# EAGLE design myir_zynq_7020_io_1 (EAGLE 7.3.0)
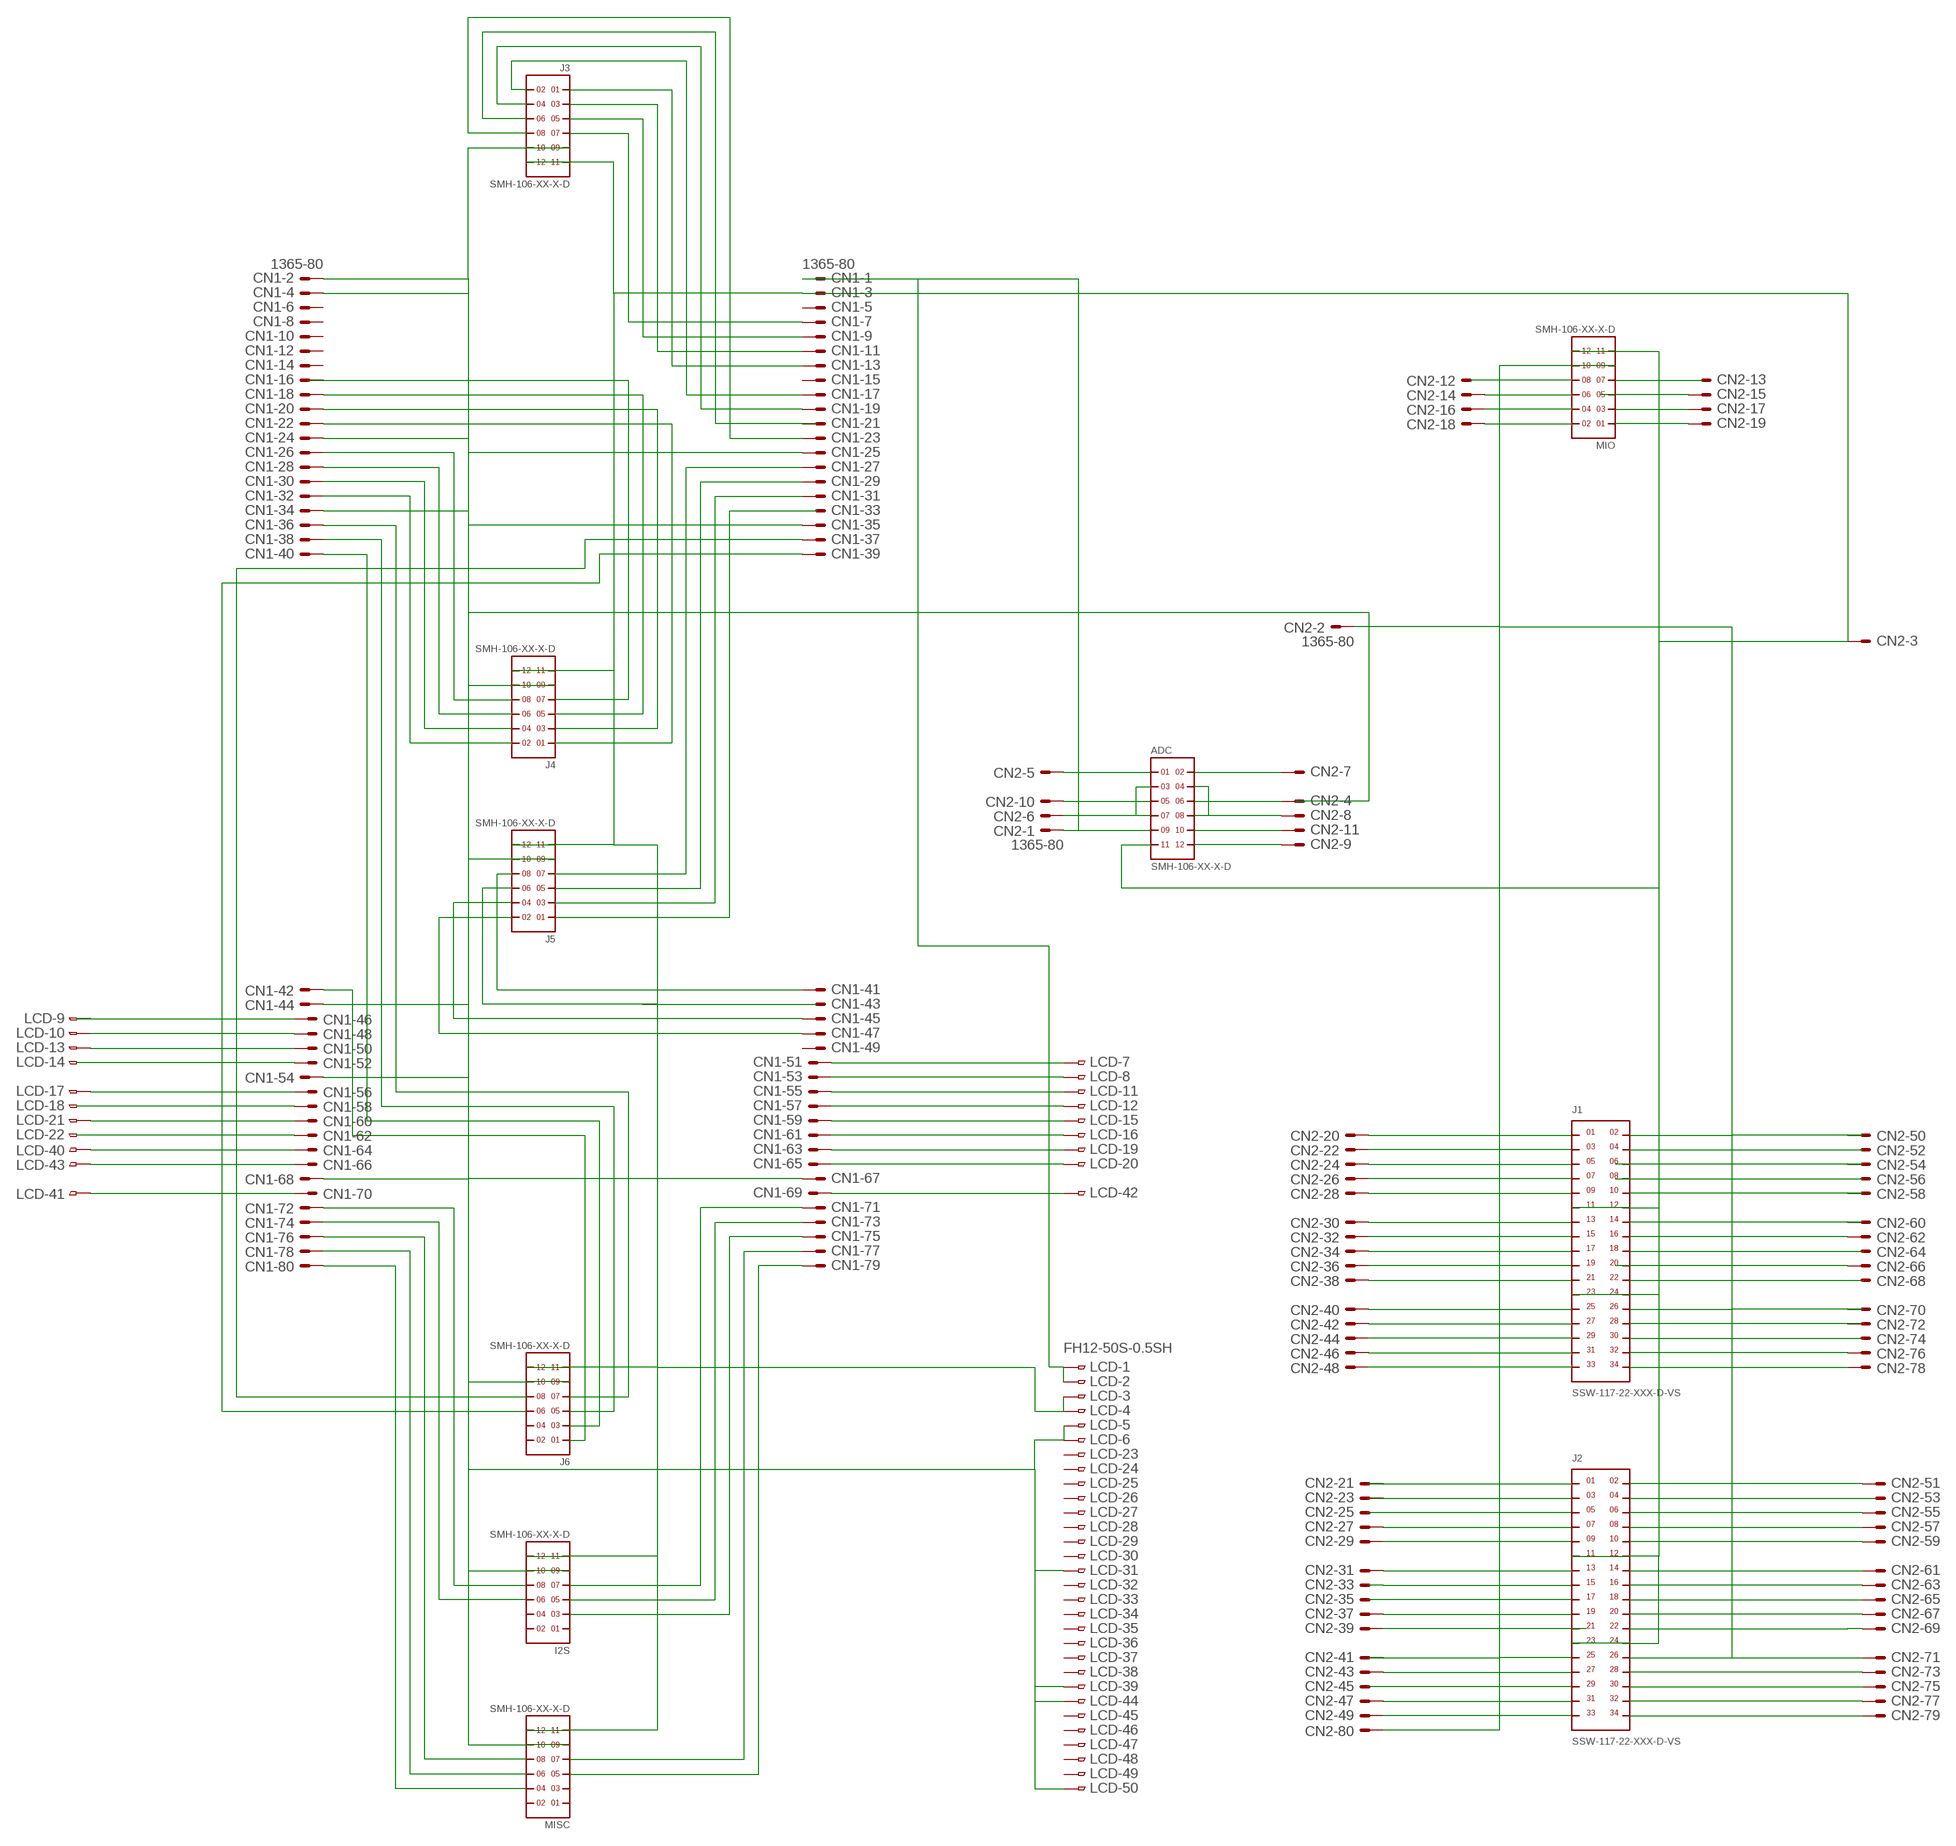
[diagram p0: schematic, sheet 1]

## Parts
ADC  SMH-106-XX-X-D  [SMH-106-XX-X-D]
CN1  1365-80  [1365-80]
CN2  1365-80  [1365-80]
I2S  SMH-106-XX-X-D  [SMH-106-XX-X-D]
J1  SSW-117-22-XXX-D-VS  [SSW-117-22-XXX-D-VS]
J2  SSW-117-22-XXX-D-VS  [SSW-117-22-XXX-D-VS]
J3  SMH-106-XX-X-D  [SMH-106-XX-X-D]
J4  SMH-106-XX-X-D  [SMH-106-XX-X-D]
J5  SMH-106-XX-X-D  [SMH-106-XX-X-D]
J6  SMH-106-XX-X-D  [SMH-106-XX-X-D]
LCD  FH12-50S-0.5SH  [FH12-50S-0.5SH]
MIO  SMH-106-XX-X-D  [SMH-106-XX-X-D]
MISC  SMH-106-XX-X-D  [SMH-106-XX-X-D]

## Nets
N$1: CN1.70 LCD.41
N$2: CN1.53 LCD.8
N$3: CN1.66 LCD.43
N$4: CN1.7 J3.7
N$5: CN1.9 J3.5
N$6: CN1.11 J3.3
N$7: CN1.13 J3.1
N$8: CN1.64 LCD.40
N$9: CN1.40 J6.3
N$10: CN1.38 J6.5
N$11: CN1.36 J6.7
N$12: CN1.42 J6.1
N$14: CN1.27 J5.7
N$15: CN1.29 J5.5
N$16: CN1.31 J5.3
N$17: J5.1
N$18: ADC.11 CN1.3 CN2.3 I2S.11 I2S.12 J1.11 J1.12 J1.23 J1.24 J2.11 J2.12 J2.23 J2.24 J3.11 J3.12 J4.11 J4.12 J5.6 J5.11 J5.12 J6.11 J6.12 LCD.3 LCD.4 MIO.11 MIO.12 MISC.11 MISC.12
N$20: CN1.41 J5.8
N$21: CN1.37 J6.8
N$22: CN1.39 J6.6
N$23: CN1.45 J5.4
N$26: CN1.51 LCD.7
N$27: CN2.62 J1.16
N$28: J1.28
N$30: J1.10
N$31: J1.18
N$32: CN2.66
N$33: J1.22
N$34: CN1.55 LCD.11
N$35: J1.30
N$36: CN1.71 I2S.7
N$37: CN1.73 I2S.5
N$38: CN1.75 I2S.3
N$39: CN1.77 MISC.7
N$40: CN1.79 MISC.5
N$41: CN1.2 CN1.4 CN1.24 CN1.25 CN1.34 CN1.35 CN1.44 CN1.54 CN1.67 CN1.68 CN2.2 CN2.20 CN2.30 CN2.31 CN2.40 CN2.51 CN2.61 CN2.71 CN2.80 I2S.9 I2S.10 J1.1 J1.2 J1.13 J1.14 J1.25 J1.26 J2.1 J2.2 J2.13 J2.14 J2.25 J2.26 J3.9 J3.10 J4.9 J4.10 J5.9 J5.10 J6.9 J6.10 LCD.5 LCD.6 LCD.31 LCD.39 LCD.44 LCD.50 MIO.9 MIO.10 MISC.9 MISC.10
N$42: CN1.57 LCD.12
N$43: CN2.76 J1.32
N$44: CN2.69 J2.22
N$45: CN2.67 J2.20
N$46: CN2.65 J2.18
N$47: CN2.63 J2.16
N$48: CN1.16 J4.7
N$49: CN1.18 J4.5
N$50: CN1.20 J4.3
N$51: CN1.17 J3.2
N$52: CN1.59 LCD.15
N$53: CN1.26 J4.8
N$54: CN1.28 J4.6
N$55: CN1.30 J4.4
N$56: CN1.61 LCD.16
N$57: CN1.32 J4.2
N$61: CN1.63 LCD.19
N$62: CN1.65 LCD.20
N$63: CN2.18 MIO.2
N$64: CN2.59 J2.10
N$65: CN2.57 J2.8
N$66: CN2.55 J2.6
N$67: CN1.46
N$68: J2.4
N$69: CN2.16 MIO.4
N$70: CN2.78 J1.34
N$71: CN2.22 J1.3
N$72: CN2.24 J1.5
N$73: CN2.26 J1.7
N$74: CN1.48 LCD.10
N$75: CN2.28 J1.9
N$76: CN1.72 I2S.8
N$77: CN1.74 I2S.6
N$78: CN1.76 MISC.8
N$79: CN1.78 MISC.6
N$80: CN1.80 MISC.4
N$81: CN2.14 MIO.6
N$82: J2.3
N$83: MIO.8
N$84: MIO.7
N$85: CN2.15
N$86: CN2.17 MIO.3
N$87: CN2.19 MIO.1
N$88: CN2.27 J2.7
N$89: ADC.12 CN2.9
N$90: CN2.29 J2.9
N$91: ADC.2 CN2.7
N$92: CN2.32 J1.15
N$93: CN2.34 J1.17
N$94: CN2.36 J1.19
N$95: CN2.38 J1.21
N$96: ADC.1 CN2.5
N$97: ADC.10 CN2.11
N$98: J2.17
N$99: CN2.25 J2.5
N$100: CN2.37 J2.19
N$101: ADC.4 ADC.8 CN2.8
N$102: CN2.39
N$103: CN2.43 J2.27
N$104: J2.29
N$105: CN2.47 J2.31
N$106: CN2.49 J2.33
N$107: ADC.3 ADC.7 CN2.6
N$108: CN2.33 J2.15
N$112: ADC.5 CN2.10
N$113: ADC.6 CN2.4
N$114: CN1.47 J5.2
N$115: CN1.22 J4.1
N$116: CN1.19 J3.4
N$117: CN2.73 J2.28
N$118: CN2.75 J2.30
N$119: CN2.77 J2.32
N$120: CN2.79 J2.34
N$121: J3.6
N$122: CN1.23 J3.8
N$141: CN2.42
N$142: CN2.44
N$143: CN2.46
N$144: CN2.48
N$146: CN2.52 J1.4
N$166: CN1.50 LCD.13
N$167: CN1.52
N$168: CN1.56 LCD.17
N$169: CN1.58
N$170: CN1.60 LCD.21
N$171: CN1.62
N$172: ADC.9 CN1.1 CN2.1 LCD.1 LCD.2
N$173: CN1.69 LCD.42
Unconnected: CN1.5 CN1.6 CN1.8 CN1.10 CN1.12 CN1.14 CN1.15 CN1.21 CN1.33 CN1.43 CN1.49 CN2.12 CN2.13 CN2.21 CN2.23 CN2.35 CN2.41 CN2.45 CN2.50 CN2.53 CN2.54 CN2.56 CN2.58 CN2.60 CN2.64 CN2.68 CN2.70 CN2.72 CN2.74 I2S.1 I2S.2 I2S.4 J1.6 J1.8 J1.20 J1.27 J1.29 J1.31 J1.33 J2.21 J6.2 J6.4 LCD.9 LCD.14 LCD.18 LCD.22 LCD.23 LCD.24 LCD.25 LCD.26 LCD.27 LCD.28 LCD.29 LCD.30 LCD.32 LCD.33 LCD.34 LCD.35 LCD.36 LCD.37 LCD.38 LCD.45 LCD.46 LCD.47 LCD.48 LCD.49 MIO.5 MISC.1 MISC.2 MISC.3

## Library data of the parts
ADC I2S J3-J6 MIO MISC = samtec:SMH-106-XX-X-D
CN1 CN2 = con-leotronics:1365-80: DUAL ROW STRAIGHT HEADER 1364 SERIES. 1.27mm x 1.27mm. Without Fixing Post. SMT Source: http://www.leotronics.co.uk/Conexcon/Data%20Sheets/sec.%20A/1364ing.pdf; OC_FARNELL: unknown; OC_NEWARK: unknown
J1 J2 = samtec:SSW-117-22-XXX-D-VS
LCD = con-hirose:FH12-50S-0.5S: 0.5mm Pitch Connectors For FPC/FFC Source: Data sheet <http://www.hirose.co.jp/cataloge_hp/e58605370.pdf>; MPN: FH12-50S-0.5SH(55); OC_FARNELL: 1324557; OC_NEWARK: 34M6181

## Board
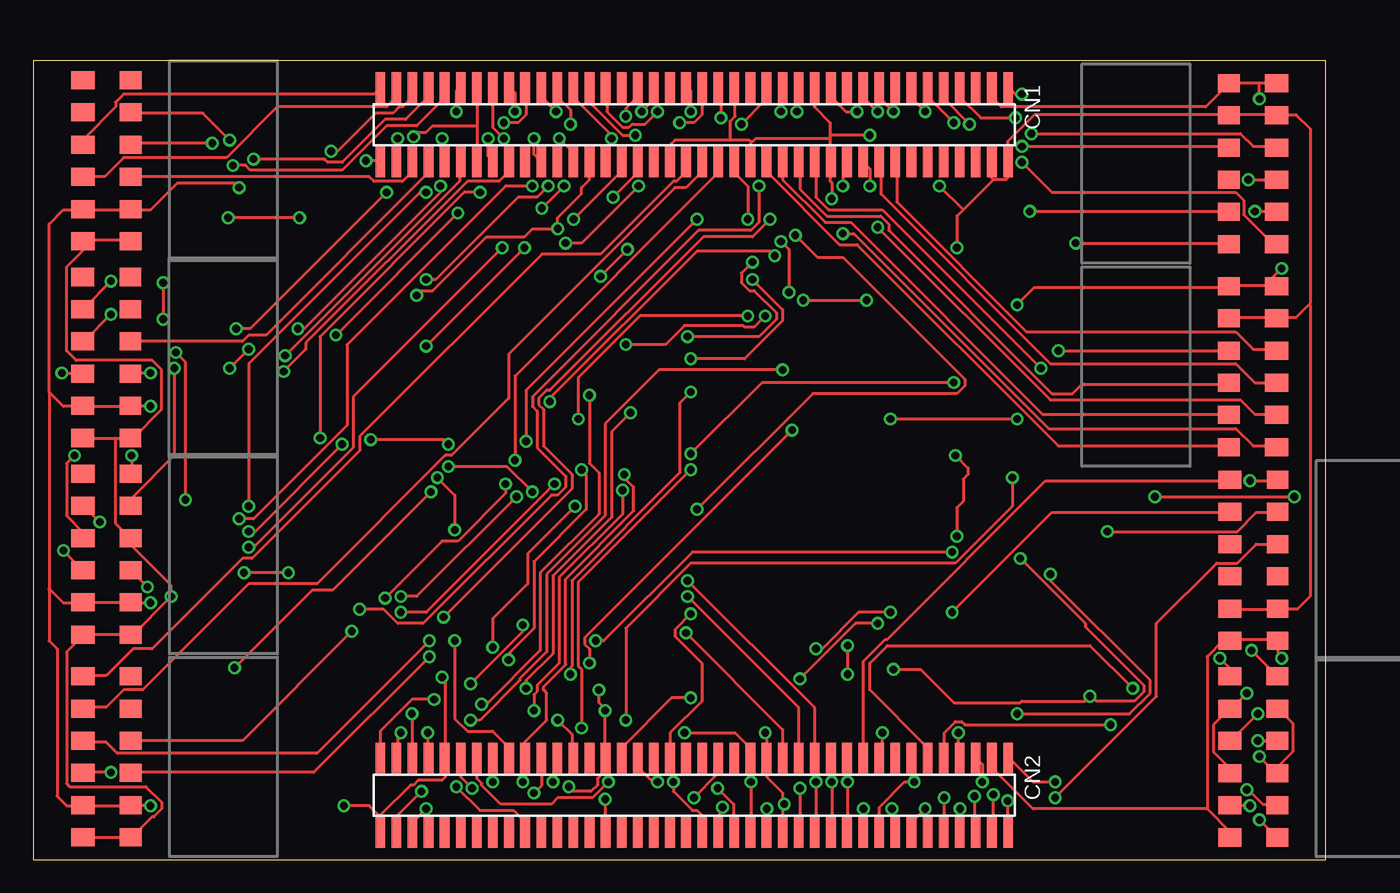
[diagram p1: board, top side]
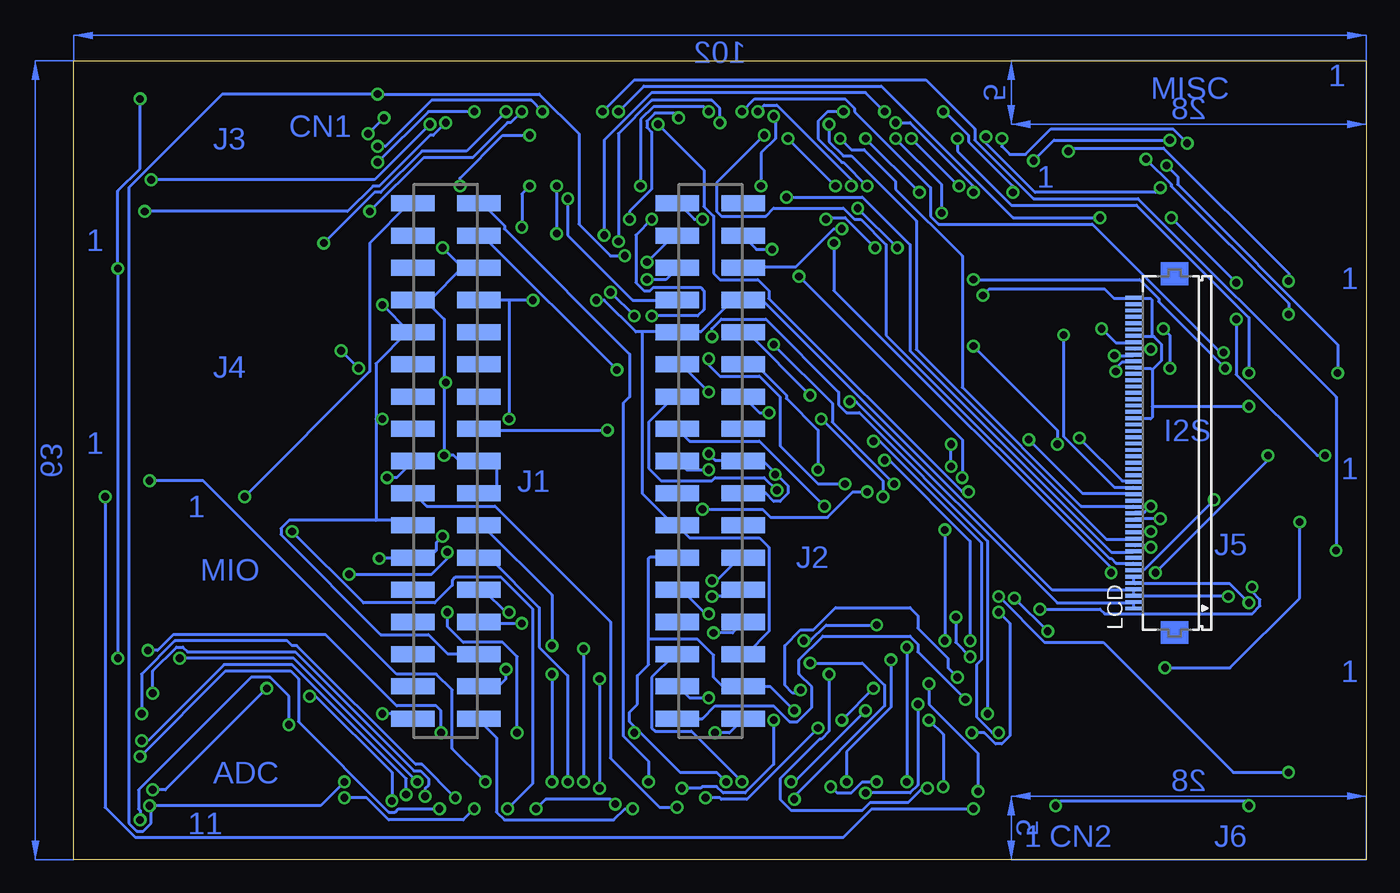
[diagram p2: board, bottom side, seen from below]

Size 102 x 63 mm. Coordinates in mm from the lower left corner, seen from the top.
Outline: 0,0 102,0 102,63 0,63 0,0
Copper layers (1*16): Top 0.035mm / dielectric 1.5mm / Bottom 0.035mm
Design rules "default *": minimum track width 10mil, minimum drill 24mil, track to track 6mil, track to pad 6mil, pad to pad 6mil, via to via 6mil, smd to smd 6mil, copper to edge 40mil, drill to drill 8mil, minimum pad ring 10mil, minimum via ring 8mil, stop-mask expansion 4mil, vias tented up to drill 0mil, thermal gap 10mil

### Footprints (pad centres in the part's own frame; a part is rotated, then mirrored left to right if it is on the bottom)
SMH-106-XX-X-D = smd 1.422 x 1.829: 1 -6.35,-1.905; 3 -3.81,-1.905; 5 -1.27,-1.905; 7 1.27,-1.905; 9 3.81,-1.905; 11 6.35,-1.905 | smd 1.422 x 1.727: 2 -6.35,1.854; 4 -3.81,1.854; 6 -1.27,1.854; 8 1.27,1.854; 10 3.81,1.854; 12 6.35,1.854
1365-80 = smd 0.76 x 2.4: 1 -24.765,-2.95; 2 -24.765,2.95; 3 -23.495,-2.95; 4 -23.495,2.95; 5 -22.225,-2.95; 6 -22.225,2.95; 7 -20.955,-2.95; 8 -20.955,2.95; 9 -19.685,-2.95; 10 -19.685,2.95; 11 -18.415,-2.95; 12 -18.415,2.95; 13 -17.145,-2.95; 14 -17.145,2.95; 15 -15.875,-2.95; 16 -15.875,2.95; 17 -14.605,-2.95; 18 -14.605,2.95; 19 -13.335,-2.95; 20 -13.335,2.95; 21 -12.065,-2.95; 22 -12.065,2.95; 23 -10.795,-2.95; 24 -10.795,2.95; 25 -9.525,-2.95; 26 -9.525,2.95; 27 -8.255,-2.95; 28 -8.255,2.95; 29 -6.985,-2.95; 30 -6.985,2.95; 31 -5.715,-2.95; 32 -5.715,2.95; 33 -4.445,-2.95; 34 -4.445,2.95; 35 -3.175,-2.95; 36 -3.175,2.95; 37 -1.905,-2.95; 38 -1.905,2.95; 39 -0.635,-2.95; 40 -0.635,2.95; 41 0.635,-2.95; 42 0.635,2.95; 43 1.905,-2.95; 44 1.905,2.95; 45 3.175,-2.95; 46 3.175,2.95; 47 4.445,-2.95; 48 4.445,2.95; 49 5.715,-2.95; 50 5.715,2.95; 51 6.985,-2.95; 52 6.985,2.95; 53 8.255,-2.95; 54 8.255,2.95; 55 9.525,-2.95; 56 9.525,2.95; 57 10.795,-2.95; 58 10.795,2.95; 59 12.065,-2.95; 60 12.065,2.95; 61 13.335,-2.95; 62 13.335,2.95; 63 14.605,-2.95; 64 14.605,2.95; 65 15.875,-2.95; 66 15.875,2.95; 67 17.145,-2.95; 68 17.145,2.95; 69 18.415,-2.95; 70 18.415,2.95; 71 19.685,-2.95; 72 19.685,2.95; 73 20.955,-2.95; 74 20.955,2.95; 75 22.225,-2.95; 76 22.225,2.95; 77 23.495,-2.95; 78 23.495,2.95; 79 24.765,-2.95; 80 24.765,2.95
SSW-117-22-XXX-D-VS = smd 1.27 x 3.429: 1 -2.54,-2.603; 2 0,-2.603; 3 -5.08,-2.603; 4 2.54,-2.603; 5 -7.62,-2.603; 6 5.08,-2.603; 7 -10.16,-2.603; 8 7.62,-2.603; 9 -12.7,-2.603; 10 10.16,-2.603; 11 -15.24,-2.603; 12 12.7,-2.603; 13 -17.78,-2.603; 14 15.24,-2.603; 15 -20.32,-2.603; 16 17.78,-2.603; 17 20.32,-2.603; 18 2.54,2.603; 19 0,2.603; 20 5.08,2.603; 21 -2.54,2.603; 22 7.62,2.603; 23 -5.08,2.603; 24 10.16,2.603; 25 -7.62,2.603; 26 12.7,2.603; 27 -10.16,2.603; 28 15.24,2.603; 29 -12.7,2.603; 30 17.78,2.603; 31 -15.24,2.603; 32 20.32,2.603; 33 -17.78,2.603; 34 -20.32,2.603
FH12-50S-0.5SH = smd 0.3 x 1.3: 1 -12.25,3.25; 2 -11.75,3.25; 3 -11.25,3.25; 4 -10.75,3.25; 5 -10.25,3.25; 6 -9.75,3.25; 7 -9.25,3.25; 8 -8.75,3.25; 9 -8.25,3.25; 10 -7.75,3.25; 11 -7.25,3.25; 12 -6.75,3.25; 13 -6.25,3.25; 14 -5.75,3.25; 15 -5.25,3.25; 16 -4.75,3.25; 17 -4.25,3.25; 18 -3.75,3.25; 19 -3.25,3.25; 20 -2.75,3.25; 21 -2.25,3.25; 22 -1.75,3.25; 23 -1.25,3.25; 24 -0.75,3.25; 25 -0.25,3.25; 26 0.25,3.25; 27 0.75,3.25; 28 1.25,3.25; 29 1.75,3.25; 30 2.25,3.25; 31 2.75,3.25; 32 3.25,3.25; 33 3.75,3.25; 34 4.25,3.25; 35 4.75,3.25; 36 5.25,3.25; 37 5.75,3.25; 38 6.25,3.25; 39 6.75,3.25; 40 7.25,3.25; 41 7.75,3.25; 42 8.25,3.25; 43 8.75,3.25; 44 9.25,3.25; 45 9.75,3.25; 46 10.25,3.25; 47 10.75,3.25; 48 11.25,3.25; 49 11.75,3.25; 50 12.25,3.25

### Placement (x,y rotation side)
ADC  96.31,8.09 270 top
CN1  52.14,57.96 180 top
CN2  52.14,5.07 180 top
I2S  5.81,39.6 270 top
J1  72.63,31.44 90 bottom
J2  51.74,31.44 90 bottom
J3  96.19,54.89 90 top
J4  96.19,38.88 90 top
J5  5.82,24.09 270 top
J6  5.82,8.1 270 top
LCD  15.12,32.06 90 bottom
MIO  96.32,23.61 270 top
MISC  5.82,55.12 270 top

### Tracks (layer width: path | path; a pad name or v marks a point on that pad's centre or on a via)
N$1  (via drill 0.61)
  Top 0.254: v19.88,39.75 33.62,53.5 33.62,55 CN1.70
  Bottom 0.254: v19.88,39.75 18.38,39.75 LCD.41
N$2  (via drill 0.61)
  Top 0.254: v47.5,57.12 46.5,57.12 44,59.62 44,60.88 CN1.53
  Bottom 0.254: v47.5,57.12 51.25,53.38 51.25,51.12 50.88,50.75 47.38,50.75 46.75,51.38 41.25,51.38 40.38,50.5 39.88,50.5 37.88,48.5 37.88,41.38 20.25,23.75 20.12,23.75 19.75,23.38 18.38,23.38 LCD.8
N$3  (via drill 0.61)
  Top 0.254: v20.88,41.88 21.38,41.88 32.12,52.62 v32.12,53.12 | v35.88,56.88 35.88,55.5 36.25,55.12 CN1.66
  Bottom 0.254: v20.88,41.88 19.75,40.75 18.38,40.75 LCD.43 | v35.88,56.88 v32.12,53.12
N$4  (via drill 0.61)
  Top 0.254: v78.75,57.25 95.25,57.25 96.25,56.25 98,56.25 J3.7 | v77.5,58.5 74.75,58.5 73.12,60.12 73.12,60.88 CN1.7
  Bottom 0.254: v77.5,58.5 v78.75,57.25
N$5  (via drill 0.61)
  Top 0.254: v95.88,53.62 98,53.62 J3.5 | v73.88,58 71.88,60 71.88,60.88 CN1.9
  Bottom 0.254: v95.88,53.62 78.25,53.62 v73.88,58
N$6  (via drill 0.61)
  Top 0.254: v96.38,51.12 98,51.12 J3.3 | v72.62,58.12 70.62,60.12 70.62,60.88 CN1.11
  Bottom 0.254: v96.38,51.12 80.38,51.12 78.38,53.12 77.88,53.12 73.88,57.12 73.62,57.12 v72.62,58.12
N$7  (via drill 0.61)
  Top 0.254: v78,55 80.38,52.62 94.88,52.62 95.5,52 95.5,50.88 97.75,48.62 98,48.62 J3.1 | v70.38,59 69.38,60 69.38,60.88 CN1.13
  Bottom 0.254: v78,55 74,59 v70.38,59
N$8  (via drill 0.61)
  Top 0.254: v19.75,38.5 21.5,40.25 21.5,40.75 34.25,53.5 36.75,53.5 37.5,54.25 37.5,55 CN1.64
  Bottom 0.254: v19.75,38.5 19.75,38.75 19.25,39.25 18.38,39.25 LCD.40
N$9
  Top 0.254: J6.3 4,12 5.75,12 7.12,13.38 8.62,13.38 17,21.75 22.38,21.75 32.5,31.88 33,31.88 37.5,36.38 37.5,39.88 50.62,53 51.5,53 52.75,54.25 52.75,55 CN1.40
N$10  (via drill 0.61)
  Top 0.254: v31.25,17.25 22.38,8.38 6.62,8.38 5.75,9.25 4,9.25 J6.5 | v38,31.5 38,38.12 54,54.12 54,55 CN1.38
  Bottom 0.254: v31.25,17.25 31.25,25.12 37.62,31.5 v38,31.5
N$11  (via drill 0.61)
  Top 0.254: v6.12,6.88 4,6.88 J6.7 | v29,20.75 30.25,20.75 v38.12,28.62 | v43,34.75 43,38 47.88,42.88 v56.38,42.88 | v56.38,50.5 56.38,53.12 55.38,54.12 55.38,55 CN1.36
  Bottom 0.254: v6.12,6.88 10.5,6.88 20.75,17.12 25.38,17.12 v29,20.75 | v38.12,28.62 38.12,29.88 v43,34.75 | v56.38,42.88 52.75,42.88 52.25,43.38 52.25,44.88 52.5,45.12 56.25,45.12 56.5,44.88 57,44.88 57.62,45.5 57.62,49.25 v56.38,50.5
N$12
  Top 0.254: J6.1 4,14.5 5.75,14.5 7.88,16.62 9.38,16.62 16.5,23.75 17.25,23.75 25.75,32.25 25.75,33.38 40.12,47.75 44.75,47.75 50.5,53.5 50.75,53.5 51.5,54.25 CN1.42
N$14  (via drill 0.61)
  Top 0.254: v2.38,24.38 3.88,22.88 J5.7 | v60.25,59 60.25,60.75 60.38,60.88 CN1.27
  Bottom 0.254: v2.38,24.38 2.38,36.5 18,52.12 26.25,52.12 30.88,56.75 30.88,57.62 34.75,61.5 57.75,61.5 v60.25,59
N$15  (via drill 0.61)
  Top 0.254: v3.25,31.88 2.62,31.25 2.62,27.12 3.88,25.88 3.88,25.38 J5.5 | v10.25,45.5 v10.25,42.62 | v21,50.62 v15.38,50.62 | v59,59 59,60.75 59.12,60.88 CN1.29
  Bottom 0.254: v3.25,31.88 3.88,31.88 10.25,38.25 v10.25,42.62 | v15.38,50.62 v10.25,45.5 | v21,50.62 27.88,50.62 38.25,61 57,61 v59,59
N$16  (via drill 0.61)
  Top 0.254: v5.25,26.62 4,27.88 J5.3 | v15.88,15.12 22,21.25 23.62,21.25 v31.38,29 | v55.88,58 57.75,59.88 57.75,60.88 CN1.31
  Bottom 0.254: v5.25,26.62 5.25,20.62 10.75,15.12 v15.88,15.12 | v31.38,29 31.88,29 47.12,44.25 47.12,44.88 48,45.75 51,45.75 51.5,46.25 51.5,50.75 52.25,51.5 52.25,54.38 v55.88,58
N$18  (via drill 0.61)
  Top 0.254: 92.62,4 94.38,2.25 94.38,1.75 ADC.11 | 92.62,4 92.62,16 93.88,17.25 94.38,17.25 MIO.11 94.5,17.38 98.12,17.38 MIO.12 98.25,17.25 98.25,16.12 v98.5,15.88 | 92.62,4 78.88,4 75.75,7.12 75.75,8 CN2.3 | 96.75,61.25 98,61.25 J3.11 | 96.75,61.25 94.38,61.25 J3.12 94.25,61.12 92.5,59.38 76.38,59.38 75.75,60 75.75,60.88 CN1.3 | v77.62,43.75 79,45.12 94.25,45.12 J4.12 94.38,45.25 98,45.25 J4.11 97.25,45.38 v98.5,46.62 | v96.75,60 96.75,61.25 | v60.75,44.12 v65.75,44.12 | MISC.12 7.62,48.88 4,48.88 MISC.11 3.88,48.75 3.88,48 2.62,46.75 2.62,40.12 3.38,39.38 9.38,39.38 10.12,38.62 10.12,35.5 7.88,33.25 I2S.12 6.5,33.25 | I2S.11 6.5,33.25 | J6.11 J6.12 7.75,1.75 9.38,3.38 9.5,3.38 10.12,4 10.12,4.5 8.88,5.75 2.88,5.75 2.62,6 2.62,16.38 3.88,17.62 J5.11 4,17.75 7.62,17.75 J5.12 7.75,17.62 v10.88,20.75 10.88,21.62 7.75,24.75 7.75,25.25 J5.6 7.62,25.38 6.5,26.5 6.5,33.25 | v67.62,34.75 v77.62,34.75
  Bottom 0.254: 78.12,26.75 75.62,26.75 75.25,26.38 J1.23 | 78.12,26.75 85,26.75 85.62,26.12 85.62,25.62 77.75,17.75 74,17.75 72.5,16.25 70.12,16.25 J1.11 | v77.62,43.75 75.5,41.62 75.25,41.62 J1.24 75.62,41.62 78.12,39.12 78.12,34.75 | v96.75,60 96.75,54.5 98.5,52.75 v98.5,46.62 v98.5,15.88 | 78.12,34.75 78.12,26.75 | J2.11 49.12,16.25 48.88,16.25 47.12,18 47.12,24.62 47.88,25.38 53.38,25.38 54.25,26.25 J2.23 54.38,26.38 54.62,26.38 57.12,28.88 57.12,41.62 | v65.75,44.12 67.62,44.12 | 67.62,44.12 70,44.12 J1.12 | v60.75,44.12 60.12,44.12 57.62,41.62 57.12,41.62 | 57.12,41.62 54.38,41.62 J2.24 54.25,41.62 52.5,41.62 50,44.12 49.25,44.12 J2.12 49.12,44.12 47.62,44.12 24.75,21.25 18.5,21.25 LCD.4 18.38,21.25 18.38,20.88 LCD.3 18.25,20.75 v10.88,20.75 | v77.62,34.75 78.12,34.75 | 67.62,44.12 v67.62,34.75
N$20  (via drill 0.61)
  Top 0.254: v9,21.5 7.75,22.75 J5.8 | v25.75,19.75 27.62,19.75 28.75,18.62 30.75,18.62 40.88,28.75 41.38,28.75 42,29.38 42,30.25 39.75,32.5 39.75,35.38 39.38,35.75 39.38,36.5 52.5,49.62 56.62,49.62 57.25,50.25 v57.25,53.12 | v51.88,59 51.88,60.62 51.62,60.88 CN1.41
  Bottom 0.254: v9,21.5 9,21.12 8.38,20.5 8.38,20 9,19.38 20.62,19.38 21,19.75 v25.75,19.75 | v57.25,53.12 57.25,58.38 56.25,59.38 52.25,59.38 v51.88,59
N$21  (via drill 0.61)
  Top 0.254: v31.25,16 22.12,6.88 7.75,6.88 J6.8 | v32.38,19.12 42.5,29.25 42.5,30.38 40.25,32.62 40.25,35.5 39.88,35.88 39.88,36.38 40.5,37 40.75,37 52.88,49.12 56.75,49.12 v58.12,50.5 | v54.25,58.5 54.25,60.75 54.12,60.88 CN1.37
  Bottom 0.254: v31.25,16 32.38,17.12 v32.38,19.12 | v58.12,50.5 58.12,51.12 56.38,52.88 56.38,57.38 56.75,57.75 56.75,58.25 56.12,58.88 54.62,58.88 v54.25,58.5
N$22  (via drill 0.61)
  Top 0.254: v25.12,18 16.5,9.38 7.75,9.38 J6.6 | v27.75,20.62 32.25,25.12 33.5,25.12 37.25,28.88 v37.25,29.62 | v46.75,40.62 49.88,40.62 51.38,42.12 56,42.12 56.12,42 56.88,42 v57.75,42.88 | v59.62,44.75 59.62,48.12 v59,48.75 | v51,58.12 52.12,58.12 52.75,58.75 52.75,60.88 CN1.39
  Bottom 0.254: v27.75,20.62 v25.12,18 | v37.25,29.62 42.12,34.5 42.12,36 v46.75,40.62 | v59.62,44.75 v57.75,42.88 | v59,48.75 59,57.25 56.38,59.88 51.62,59.88 51,59.25 v51,58.12
N$23  (via drill 0.61)
  Top 0.254: v11.12,38.75 11.12,31.88 7.75,28.5 7.75,28 J5.4 | v31,45.75 31.75,45.75 38.25,52.25 39.75,52.25 v40.62,53.12 | v48,59 48.88,59.88 48.88,60.88 CN1.45
  Bottom 0.254: v11.12,38.75 16.38,44 16.38,44.25 17.88,45.75 v31,45.75 | v40.62,53.12 40.62,53.62 46.5,59.5 47.5,59.5 v48,59
N$26  (via drill 0.61)
  Top 0.254: v12,28.38 12,39.25 v11.25,40 | v49.25,59 48.25,58 47.25,58 47,57.75 46.5,57.75 45.25,59 45.25,60.88 CN1.51
  Bottom 0.254: v12,28.38 17.5,22.88 18.25,22.88 LCD.7 | v11.25,40 11.5,40 21.62,50.12 33.75,50.12 34.38,50.75 34.38,53 40.38,59 40.38,59.25 41.12,60 48.25,60 v49.25,59
N$27  (via drill 0.61)
  Top 0.254: v33.38,5.75 35.25,3.88 37.88,3.88 38.75,3 38.75,2.12 CN2.62 | v34.5,11 35.25,11 38.38,14.12 38.38,14.25 40.5,16.38 40.5,22.5 45.12,27.12 45.12,34.38 49.38,38.62 v59.12,38.62
  Bottom 0.254: v33.38,5.75 33.38,9.88 v34.5,11 | v59.12,38.62 69.62,49.12 70,49.12 J1.16
N$34  (via drill 0.61)
  Top 0.254: v17,24.62 17.38,24.62 25.25,32.5 25.25,36.5 v37,48.25 | v41.88,53.12 v40.12,51.38 | v45.62,56.88 45.62,57.12 42.62,60.12 42.62,60.88 CN1.55
  Bottom 0.254: v17,24.62 17.12,24.75 18.25,24.75 LCD.11 | v40.12,51.38 v37,48.25 | v45.62,56.88 v41.88,53.12
N$36  (via drill 0.61)
  Top 0.254: v2.25,38.38 3.88,38.38 I2S.7 | v15.75,54.75 16.75,54.75 17.12,54.38 24.38,54.38 27.88,57.88 30.25,57.88 32.38,60 32.38,60.88 CN1.71
  Bottom 0.254: v2.25,38.38 2.25,40.62 14.88,53.25 14.88,53.88 v15.75,54.75
N$37  (via drill 0.61)
  Top 0.254: v6.12,43 4,40.88 I2S.5 | v17.38,55.25 23,55.25 23.25,55 24.38,55 27.75,58.38 29.38,58.38 31.12,60.12 31.12,60.88 CN1.73
  Bottom 0.254: v6.12,43 6.12,43.88 15.38,53.12 15.38,53.25 v17.38,55.25
N$38  (via drill 0.61)
  Top 0.254: v6.12,45.62 4,43.5 I2S.3 | v23.5,55.88 24,55.88 27,58.88 28.38,58.88 28.88,59.38 29.12,59.38 29.88,60.12 29.88,60.88 CN1.75
  Bottom 0.254: v6.12,45.62 6.12,46.25 16,56.12 23.25,56.12 v23.5,55.88
N$39
  Top 0.254: MISC.7 4,53.88 5.62,53.88 7.12,55.38 15.25,55.38 19.25,59.38 27.88,59.38 28.62,60.12 28.62,60.88 CN1.77
N$40
  Top 0.254: MISC.5 4,56.5 4,56.88 6.5,59.38 6.5,59.75 7.12,60.38 26.88,60.38 27.38,60.88 CN1.79
N$41  (via drill 0.61)
  Top 0.254: 27.38,3.5 CN2.80 | 27.38,3.5 29.75,5.88 30,5.88 30.38,6.25 32.25,6.25 32.5,6.5 32.5,8 CN2.71 32.5,8.12 32.5,14.12 v32.25,14.38 | v9.25,4.25 7.75,4.25 J6.10 7.62,4.25 4,4.25 J6.9 3.88,4.25 2.62,4.25 1.88,5 1.88,16.62 1.25,17.25 1.25,21.25 1.31,21.31 | v24.5,4.25 26.5,4.25 27.25,3.5 27.38,3.5 | CN1.54 43.88,53.62 43.25,53 43.25,52.5 41.38,50.62 v41.38,49.75 39.38,49.75 38.75,49.12 35.75,49.12 31.5,44.88 30.62,44.88 v30.25,44.5 | v9.25,20.25 7.75,20.25 J5.10 7.62,20.25 4,20.25 J5.9 3.88,20.25 2.38,20.25 1.31,21.31 | 35,57.88 35,60.88 CN1.67 | 35,57.88 35,55.12 CN1.68 | v9.25,35.75 7.75,35.75 I2S.10 7.62,35.75 4,35.75 I2S.9 3.88,35.75 2.38,35.75 1.25,36.88 | 1.25,36.88 1.25,50.12 2.38,51.25 3.88,51.25 MISC.9 4,51.25 7.62,51.25 MISC.10 7.75,51.25 9.25,51.25 11.38,53.38 15.88,53.38 v16.25,53 | 35,57.88 31.5,57.88 31,57.38 30.38,57.38 v30,57 | 1.31,21.31 1.25,21.38 1.25,36.88 | v50.5,6.12 50.5,5.38 52,3.88 52.38,3.88 52.75,3.5 52.75,2.12 CN2.40 | v57.75,10 57.75,9.75 57.88,9.62 57.88,8.12 CN2.31 57.88,8 57.88,6.5 59.12,5.25 59.12,4.38 | 59.12,4.38 CN2.30 | v65.5,4 65.5,2.12 CN2.20 | v59.25,4.38 59.12,4.38 | v38.62,6.12 38.75,6.25 38.75,8 CN2.61 38.75,8.12 38.75,9.25 40.5,11 40.5,13.12 40.25,13.38 40.25,13.62 42,15.38 42,22.12 47.38,27.5 47.38,29.38 46.62,30.12 v46.62,30.38 | v42.25,5.75 42.62,5.38 44,5.38 44.5,5.88 44.5,6.38 45.12,7 45.12,8 CN2.51 45.12,8.12 v45.12,11.75 45.12,11.88 44.62,12.38 v44.62,13.38 | 55,56.75 56.5,56.75 56.62,56.62 | 55,56.75 50.62,56.75 50.25,56.38 50.25,55.12 CN1.44 | 56.62,56.62 56.62,55.12 CN1.34 | 55,56.75 55,58.25 55.38,58.62 55.38,60.88 CN1.35
  Top 0.254: 62.88,57.12 62.88,58.12 61.62,59.38 61.62,60.88 CN1.25 | 62.88,57.12 62.88,56.88 | 62.88,56.88 62.88,55.12 CN1.24 62.88,55 62.88,53.5 63,53.38 v63,52.12 | 62.88,56.88 57,56.88 56.75,56.62 56.62,56.62 | v76.88,4.62 76.88,2.12 CN2.2 | v67.88,15 70,15 72.62,12.38 77.88,12.38 78,12.5 83,12.5 v83.38,12.88 83.5,12.88 83.88,12.5 86.88,12.5 87.62,13.25 87.62,13.75 83,18.38 83,18.62 v77.88,23.75 | v72.88,25.5 72.88,27.75 73.38,28.25 73.38,30 73.75,30.38 73.75,30.88 v72.75,31.88 | MIO.9 94.5,19.75 98.12,19.75 MIO.10 98.25,19.75 99.75,19.75 100.75,20.75 100.75,43.75 100.69,43.81 | J4.10 94.38,42.75 98,42.75 J4.9 98.12,42.75 99.62,42.75 100.69,43.81 | 75.75,53.62 75.62,53.75 75.62,55 CN1.4 | 75.75,53.62 76.75,53.62 76.88,53.75 76.88,55 CN1.2 76.88,55.12 76.88,56.62 79,58.75 94.25,58.75 J3.10 94.38,58.75 98,58.75 J3.9 98.12,58.75 99.62,58.75 100.75,57.62 100.75,43.88 100.69,43.81 | v72.88,48.25 72.88,50.75 73.38,51.25 | 75.75,53.62 73.38,51.25 | v66,57.12 62.88,57.12 | 73.38,51.25 v71.5,53.12 | v51.88,32 57.5,37.62 v72.62,37.62
  Bottom 0.254: v9.25,4.25 9.25,4.5 9.38,4.62 24.12,4.62 v24.5,4.25 | v41.38,49.75 42,49.75 45,46.75 47.5,46.75 47.62,46.62 49.12,46.62 J2.14 | LCD.6 18.38,22.25 18.38,21.88 LCD.5 18.25,21.75 10.75,21.75 v9.25,20.25 | 16.88,38.62 16.88,35.75 | 16.88,35.75 16.88,34.88 17,34.75 18.25,34.75 LCD.31 | 16.88,38.62 17,38.75 18.25,38.75 LCD.39 | 16.88,41.25 16.75,41.25 16.12,40.62 16.12,39.38 16.88,38.62 | 16.88,41.25 18.25,41.25 LCD.44 | 16.88,41.25 16.88,44.12 17,44.25 18.25,44.25 LCD.50 18.38,44.25 19.88,44.25 20.62,45 29.75,45 v30.25,44.5 | 16.88,35.75 v9.25,35.75 | v30,57 30,56.5 26.12,52.62 16.62,52.62 v16.25,53 | v50.5,6.12 51.25,6.88 54.12,6.88 57.25,10 v57.75,10 57.38,10.12 58.12,10.88 58.12,11.62 57.5,12.25 57.5,14.5 56.62,15.38 56.62,17.38 | v65.5,4 64.75,4.75 59.62,4.75 v59.25,4.38 | 56.62,17.38 56.62,23.75 56.5,23.88 54.38,23.88 J2.25 | 46.56,30.44 47.62,31.5 49.12,31.5 J2.2 49.25,31.5 51.38,31.5 v51.88,32 | 46.56,30.44 45.62,29.5 45.62,28.88 46.25,28.25 46.75,28.25 47.38,28.88 49.12,28.88 J2.1 | v38.62,6.12 39.75,6.12 40.62,5.25 41.75,5.25 v42.25,5.75 | v45.12,11.75 47,13.62 49.12,13.62 J2.13 49.25,13.62 50.75,13.62 51.5,14.38 51.5,16.12 52.75,17.38 56.62,17.38 | v46.62,30.38 46.56,30.44 | v63,52.12 63,49.25 57.88,44.12 54.38,44.12 J2.26 | v76.88,4.62 76.88,6.88 82.88,12.88 v83.38,12.88 | v67.88,15 67.88,14.25 68.5,13.62 70,13.62 J1.13 | J1.1 70,28.88 68.75,28.88 68.62,29 68.62,31.38 68.75,31.5 70,31.5 J1.2 70.12,31.5 71.62,31.5 72,31.88 v72.75,31.88 72.75,37.62 | v72.88,25.5 73.38,25 73.38,24.38 73.88,23.88 75.12,23.88 J1.25 75.25,23.88 76.75,23.88 76.88,23.75 v77.88,23.75
  Bottom 0.254: v72.88,48.25 71.38,46.75 J1.14 70.12,46.62 71.38,46.62 73.88,44.12 75.12,44.12 J1.26 74.12,44 72.75,42.62 72.75,37.62 | v66,57.12 68.12,57.12 71.5,53.75 v71.5,53.12 | v72.62,37.62 72.75,37.62 | v32.25,14.38 33,15.12 33,15.88 35.38,18.25 35.38,19.25 36,19.88 41.88,19.88 43.62,18.12 44.62,18.12 45.88,16.88 45.88,13.75 45.25,13.12 44.88,13.12 v44.62,13.38
N$42  (via drill 0.61)
  Top 0.254: v42.38,58 42.38,59.12 41.38,60.12 41.38,60.88 CN1.57
  Bottom 0.254: v42.38,58 42.38,56.62 41.25,55.5 40.62,55.5 35.5,50.38 35.5,40.25 20.5,25.25 18.38,25.25 LCD.12
N$43  (via drill 0.61)
  Top 0.254: v31,4 30,3 30,2.12 CN2.76 | v88.5,28.62 v99.5,28.62
  Bottom 0.254: v31,4 39,4 41.25,1.75 97.12,1.75 99.5,4.12 v99.5,28.62 | v88.5,28.62 78.62,38.5 78.62,48.62 75.5,51.75 75.25,51.75 J1.32
N$44  (via drill 0.61)
  Top 0.254: v34.62,5.62 33.75,6.5 33.75,8 CN2.69 | v42.38,14.62 42.38,15.12 42.5,15.25 42.5,22 51,30.5 51,36 v51.88,36.88
  Bottom 0.254: v34.62,5.62 35,5.62 36.12,4.5 39.12,4.5 39.75,3.88 45.38,3.88 46.25,4.75 46.25,6.38 43.12,9.5 43,9.5 42.38,10.12 v42.38,14.62 | v51.88,36.88 54,39 54.25,39 J2.22
N$45  (via drill 0.61)
  Top 0.254: v45.38,6.12 44.12,4.88 41.38,4.88 40.88,4.38 36.88,4.38 35.38,5.88 35.38,6 35,6.38 35,8 CN2.67 | v39.5,11.75 39.5,13 39.75,13.25 39.75,13.75 41.5,15.5 41.5,22.25 46.5,27.25 v46.5,29.12
  Bottom 0.254: v45.38,6.12 45.12,6.12 v39.5,11.75 | v46.5,29.12 47.5,30.12 51.38,30.12 51.62,29.88 55.62,29.88 56.62,30.88 56.62,34.5 54.62,36.5 54.38,36.5 J2.20
N$46  (via drill 0.61)
  Top 0.254: v36.25,6.12 36.25,8 CN2.65 | v36.25,16.75 36.25,19 39,21.75 39,24.12 v42.75,27.88
  Bottom 0.254: v36.25,16.75 v36.25,6.12 | v42.75,27.88 47.88,33 53.38,33 54.25,33.88 J2.18
N$47  (via drill 0.61)
  Top 0.254: v33.25,17.25 33.25,11.12 34.25,10.12 36.25,10.12 37.5,8.88 37.5,8.12 CN2.63 | v33.25,26 33.25,28.75 v31.88,30.12 | v46.88,48.12 v44.75,46
  Bottom 0.254: v33.25,26 v33.25,17.25 | v31.88,30.12 31.88,33.12 v44.75,46 | v46.88,48.12 48.12,48.12 49.12,49.12 J2.16
N$48
  Top 0.254: J4.7 98,40.25 96.25,40.25 94.88,41.62 78.38,41.62 68.12,51.88 68.12,55 CN1.16
N$49
  Top 0.254: J4.5 98,37.62 96.38,37.62 94.88,39.12 80.25,39.12 66.88,52.5 66.88,54.88 CN1.18
N$50  (via drill 0.61)
  Top 0.254: v66.62,49.88 80.25,36.25 95.25,36.25 96.38,35.12 98,35.12 J4.3 | v66,53.12 66,54.5 65.5,55 CN1.20
  Bottom 0.254: v66.62,49.88 66.62,52.5 v66,53.12
N$51  (via drill 0.61)
  Top 0.254: v82.25,48.62 94.25,48.62 J3.2 | v67.88,59 66.75,60.12 66.75,60.88 CN1.17
  Bottom 0.254: v82.25,48.62 78.25,52.62 77.75,52.62 74.5,55.88 71,55.88 v67.88,59
N$52  (via drill 0.61)
  Top 0.254: v16.25,26.88 17.38,26.88 24.75,34.25 24.75,40.62 37.25,53.12 v39.38,53.12 | v41.25,59 40.12,60.12 40.12,60.88 CN1.59
  Bottom 0.254: v16.25,26.88 18.25,26.88 LCD.15 | v39.38,53.12 41.25,55 41.38,55 43.25,56.88 43.25,58.25 42.5,59 v41.25,59
N$53  (via drill 0.61)
  Top 0.254: v80.88,40.12 94.25,40.12 J4.8 | v79.5,38.75 67,51.25 62.75,51.25 61.75,52.25 61.75,55 CN1.26
  Bottom 0.254: v79.5,38.75 v80.88,40.12
N$54
  Top 0.254: J4.6 94.25,37.5 82.75,37.5 82,36.75 80.38,36.75 67.5,49.62 67.5,50.12 66.88,50.75 62.62,50.75 60.5,52.88 60.5,55 CN1.28
N$55
  Top 0.254: CN1.30 59.12,53.62 62.5,50.25 64.5,50.25 79.62,35.12 94.25,35.12 J4.4
N$56  (via drill 0.61)
  Top 0.254: v17,27.88 17,39.12 30.5,52.62 v31,52.62 | v37.12,58.12 38.25,58.12 38.88,58.75 38.88,60.88 CN1.61
  Bottom 0.254: v17,27.88 17.5,27.38 18.25,27.38 LCD.16 | v31,52.62 31,53.12 36,58.12 v37.12,58.12
N$57
  Top 0.254: J4.2 94.25,32.62 80.88,32.62 65,48.5 63.62,48.5 57.88,54.25 57.88,55 CN1.32
N$61  (via drill 0.61)
  Top 0.254: v26.62,33.12 32.38,33.12 v32.75,32.75 | v32.75,31 37.38,31 v39.38,29 | v52.38,27.62 61.5,36.75 72.88,36.75 73.5,37.38 73.5,37.88 63.88,47.5 61.88,47.5 v60.12,49.25 | v38,59 38,60.5 37.62,60.88 CN1.63
  Bottom 0.254: v26.62,33.12 22.38,28.88 18.38,28.88 LCD.19 | v32.75,31 v32.75,32.75 | v39.38,29 40.5,29 42.5,27 47,27 47.62,27.62 v52.38,27.62 | v60.12,49.25 60.12,56.75 56.38,60.5 39.5,60.5 v38,59
N$62  (via drill 0.61)
  Top 0.254: v33.5,51 v23.88,41.38 | v37.12,56.88 36.25,57.75 36.25,60.88 CN1.65
  Bottom 0.254: v23.88,41.38 23.88,33.38 19.88,29.38 18.38,29.38 LCD.20 | v33.5,51 33.5,53.25 v37.12,56.88
N$63  (via drill 0.61)
  Top 0.254: v96,29.88 98.12,29.88 MIO.2 | v69.5,6.12 68.75,6.12 66.75,4.12 CN2.18
  Bottom 0.254: v96,29.88 91.75,29.88 76.5,14.62 73.38,14.62 72.12,13.38 72.12,8.75 v69.5,6.12
N$64  (via drill 0.61)
  Top 0.254: v39.5,5.25 40.12,5.88 40.12,8 CN2.59 | v35.38,12.25 35.75,12.25 40,16.5 40,22.62 44.62,27.25 44.62,30.5 43.88,31.25 v43.88,36.62
  Bottom 0.254: v39.5,5.25 36,5.25 35.38,5.88 v35.38,12.25 | v43.88,36.62 48.88,41.62 49.12,41.62 J2.10
N$65  (via drill 0.61)
  Top 0.254: v41,6.12 41.25,6.38 41.25,8 CN2.57 | v37.5,15.75 37.5,16.25 39.5,18.25 39.5,23.5 43.62,27.62 43.62,30.38 v43.25,30.75
  Bottom 0.254: v41,6.12 41,8.5 37.5,12 v37.5,15.75 | v43.25,30.75 43.25,33.88 45.75,36.38 45.75,36.62 48.12,39 49.12,39 J2.8
N$66  (via drill 0.61)
  Top 0.254: v41.38,11 42.5,9.88 42.5,8.12 CN2.55 | v38.88,13.5 38.88,14.12 41,16.25 41,22.38 45.62,27 45.62,33.75 v47.12,35.25
  Bottom 0.254: v38.88,13.5 v41.38,11 | v47.12,35.25 47.88,35.25 49.12,36.5 J2.6
N$69  (via drill 0.61)
  Top 0.254: v84.75,25.88 95,25.88 96.5,27.38 98.12,27.38 MIO.4 | v67.75,4 67.75,2.38 68,2.12 CN2.16
  Bottom 0.254: v84.75,25.88 79.12,20.25 73.5,20.25 72.12,21.62 72.12,22 71.88,22.25 68.25,22.25 65.75,19.75 65.75,6 v67.75,4
N$70  (via drill 0.61)
  Top 0.254: v30.62,5.38 28.75,3.5 28.75,2.12 CN2.78 | v34.5,13.88 38.62,18 v38.62,18.5 | v44.38,17.25 45,17.25 52,24.25 v72.5,24.25 | v80.25,22.5 80.25,22 88.12,14.12 88.12,13.12 86.5,11.5 v77.62,11.5
  Bottom 0.254: v30.62,5.38 30.62,8.38 34.5,12.25 v34.5,13.88 | v38.62,18.5 42.62,18.5 43.88,17.25 v44.38,17.25 | v72.5,24.25 72.5,23.75 73.75,22.5 v80.25,22.5 | v77.62,11.5 75.62,11.5 75.25,11.12 J1.34
N$71  (via drill 0.61)
  Top 0.254: v64.25,6.12 64.25,2.12 CN2.22 | v64.25,16.88 v64.25,14.62
  Bottom 0.254: v64.25,14.62 v64.25,6.12 | v64.25,16.88 64.25,20.88 69.62,26.25 70,26.25 J1.3
N$72  (via drill 0.61)
  Top 0.254: v63,6.12 63,2.12 CN2.24
  Bottom 0.254: v63,6.12 63,14.5 65.25,16.75 65.25,19.88 69.12,23.75 70,23.75 J1.5
N$73  (via drill 0.61)
  Top 0.254: v61.75,6.12 61.75,2.12 CN2.26 | v61.75,16.62 62.25,16.62 65.12,19.5 v67.62,19.5
  Bottom 0.254: v61.75,16.62 v61.75,6.12 | v67.62,19.5 67.88,19.5 69.62,21.25 70,21.25 J1.7
N$74  (via drill 0.61)
  Top 0.254: v45.75,52.25 47.62,54.12 47.62,55 CN1.48
  Bottom 0.254: v45.75,52.25 39.75,52.25 36,48.5 36,40.12 20.12,24.25 18.38,24.25 LCD.10
N$75  (via drill 0.61)
  Top 0.254: v60.5,5.62 60.5,2.12 CN2.28 | v60.5,14.25 64.88,18.62 v66.62,18.62
  Bottom 0.254: v60.5,14.25 v60.5,5.62 | v66.62,18.62 70,18.62 J1.9
N$76  (via drill 0.61)
  Top 0.254: v9.25,38.38 7.75,38.38 I2S.8 | v32.25,56.88 32.25,55.25 32.38,55.12 CN1.72
  Bottom 0.254: v9.25,38.38 9.25,42.75 18.12,51.62 28,51.62 32.25,55.88 v32.25,56.88
N$77
  Top 0.254: I2S.6 7.75,40.88 16.5,40.88 17,41.38 18.38,41.38 31.12,54.12 31.12,55 CN1.74
N$78
  Top 0.254: MISC.8 7.75,53.88 26.5,53.88 26.88,53.5 29.12,53.5 29.88,54.25 29.88,55 CN1.76
N$79  (via drill 0.61)
  Top 0.254: v14.12,56.5 7.75,56.5 MISC.6 | v28.75,56.88 28.75,55.12 CN1.78
  Bottom 0.254: v14.12,56.5 15.25,57.62 24.88,57.62 26.88,55.62 28.12,55.62 28.75,56.25 v28.75,56.88
N$80  (via drill 0.61)
  Top 0.254: v15.5,56.75 13.38,58.88 7.75,58.88 MISC.4 | v26.25,55.12 27.38,55.12 CN1.80
  Bottom 0.254: v15.5,56.75 24.62,56.75 v26.25,55.12
N$81  (via drill 0.61)
  Top 0.254: v80.62,4.88 88.62,12.88 88.62,18.62 93.38,23.38 95,23.38 96.5,24.88 98.12,24.88 MIO.6 | v70.38,4 69.38,3 69.38,2.12 CN2.14
  Bottom 0.254: v80.62,4.88 78.88,4.88 77.12,3.12 71.25,3.12 v70.38,4
N$86  (via drill 0.61)
  Top 0.254: v72.5,19.5 80.38,27.38 94.38,27.38 MIO.3 | v67,10 67,8.38 66.75,8.12 CN2.17
  Bottom 0.254: v72.5,19.5 72.5,18.38 71.25,17.12 68.12,17.12 67,16 v67,10
N$87
  Top 0.254: MIO.1 94.38,29.88 79.88,29.88 67.38,17.38 67.25,17.38 65.5,15.62 65.5,8.12 CN2.19
N$88  (via drill 0.61)
  Top 0.254: v51.62,20.75 60.38,12 60.38,8.12 CN2.27
  Bottom 0.254: v51.62,20.75 49.75,20.75 49.25,21.25 J2.7
N$89  (via drill 0.61)
  Top 0.254: v96.75,3.12 98.12,1.75 ADC.12 | v85,10.62 73.5,10.62 73.25,10.88 72.75,10.88 71.88,10 71.88,8.12 CN2.9
  Bottom 0.254: v96.75,3.12 96.75,3.88 96.88,4 96.88,5.5 88,14.38 86.5,14.38 85,12.88 v85,10.62
N$90  (via drill 0.61)
  Top 0.254: CN2.29 59.12,10.25 v51.5,17.88
  Bottom 0.254: v51.5,17.88 50,17.88 49.25,18.62 J2.9
N$91  (via drill 0.61)
  Top 0.254: v96.12,16.5 98.12,14.5 ADC.2 | v73,10 73,8.12 CN2.7
  Bottom 0.254: v96.12,16.5 95.38,16.5 94.12,17.75 82.12,17.75 76.5,12.12 73.38,12.12 73,11.75 v73,10
N$92  (via drill 0.61)
  Top 0.254: v57.88,4 57.88,2.12 CN2.32
  Bottom 0.254: v57.88,4 58.5,4 59.38,3.12 68,3.12 68.62,3.75 68.62,9.62 70,11 J1.15
N$93  (via drill 0.61)
  Top 0.254: v56.62,6.12 56.62,2.12 CN2.34
  Bottom 0.254: v56.62,6.12 56.62,7.75 58.62,9.75 58.62,36 58.12,36.5 58.12,39.88 68,49.75 68,50 69.75,51.75 70,51.75 J1.17
N$94  (via drill 0.61)
  Top 0.254: v54,5.62 55.25,4.38 55.25,2.12 CN2.36 | v46.75,11 46.75,18.25 51.88,23.38 72.75,23.38 77.25,27.88 v77.25,30.12
  Bottom 0.254: v54,5.62 52.5,5.62 52.38,5.75 51.25,5.75 50.75,5.25 49,5.25 46.75,7.5 v46.75,11 | v77.25,30.12 76.5,30.12 75.25,31.38 J1.19
N$95  (via drill 0.61)
  Top 0.254: v54.38,4.12 54.12,3.88 54.12,2.12 CN2.38
  Bottom 0.254: v54.38,4.12 55.75,4.12 59.62,8 59.62,18.75 68.75,27.88 74.12,27.88 75.12,28.88 J1.21
N$96  (via drill 0.61)
  Top 0.254: v93.62,15.88 94.38,15.12 94.38,14.5 ADC.1 | v74.88,6.12 74.88,7.5 74.38,8 CN2.5
  Bottom 0.254: v93.62,15.88 84.62,15.88 v74.88,6.12
N$97  (via drill 0.61)
  Top 0.254: v95.75,5.5 95.88,5.5 97,4.38 98.12,4.38 ADC.10 | v86.75,13.5 83.38,16.88 67.38,16.88 66,15.5 66,13.38 70.5,8.88 70.5,8.12 CN2.11
  Bottom 0.254: v95.75,5.5 94.75,5.5 v86.75,13.5
N$99  (via drill 0.61)
  Top 0.254: v51.62,22 61.62,12 61.62,8.12 CN2.25
  Bottom 0.254: v51.62,22 51.25,22 49.5,23.75 49.25,23.75 J2.5
N$100  (via drill 0.61)
  Top 0.254: v52.12,4.88 54,6.75 54,8 CN2.37 | v43.25,10.38 43.25,15 43,15.25 43,21.88 v51.88,30.75
  Bottom 0.254: v52.12,4.88 51,4.88 50.88,4.75 48.88,4.75 v43.25,10.38 | v51.88,30.75 53.62,30.75 54.25,31.38 J2.19
N$101  (via drill 0.61)
  Top 0.254: ADC.4 98.25,11.88 99.38,10.75 99.38,8.5 98.25,7.38 98.25,6.88 ADC.8 98.12,6.75 v96.75,8.12 | v73.12,4 73.12,2.12 CN2.8
  Bottom 0.254: v73.12,4 76.38,4 76.62,3.75 77.12,3.75 84.25,10.88 84.25,14.25 84.88,14.88 90,14.88 v96.75,8.12
N$103  (via drill 0.61)
  Top 0.254: v51.88,19.38 50.62,18.12 50.62,17.62 52.75,15.5 52.75,12.5 50.25,10 50.25,8.12 CN2.43
  Bottom 0.254: v51.88,19.38 52.12,19.38 54,21.25 54.25,21.25 J2.27
N$105  (via drill 0.61)
  Top 0.254: v49.25,6.12 48.88,6.12 47.75,7.25 47.75,8 CN2.47
  Bottom 0.254: v49.25,6.12 53.25,10.12 56.12,10.12 56.38,10.38 56.38,14.38 54.62,16.12 54.38,16.12 J2.31
N$106  (via drill 0.61)
  Top 0.254: v51.88,12.75 50.38,12.75 46.5,8.88 46.5,8.12 CN2.49
  Bottom 0.254: v51.88,12.75 53.38,12.75 54.25,13.62 J2.33
N$107  (via drill 0.61)
  Top 0.254: ADC.7 94.38,6.88 94.38,7.25 93.12,8.5 93.12,10.62 94.38,11.88 ADC.3 94.5,11.88 v95.75,13.12 | v74.25,5 74.25,2.12 CN2.6
  Bottom 0.254: v74.25,5 74.25,5.62 74,5.88 74,6.38 74.62,7 75.12,7 84.5,16.38 93,16.38 93.38,16.75 93.88,16.75 95.75,14.88 v95.75,13.12
N$108  (via drill 0.61)
  Top 0.254: v51.38,10 55.38,10 56.5,8.88 56.5,8.12 CN2.33
  Bottom 0.254: v51.38,10 50.25,10 49.25,11 J2.15
N$112  (via drill 0.61)
  Top 0.254: v96.62,11.5 94.5,9.38 ADC.5 | v71.88,4.88 71.88,2.12 CN2.10
  Bottom 0.254: v96.62,11.5 96.62,14.62 94,17.25 85.12,17.25 84.75,16.88 84.38,16.88 75,7.5 74.5,7.5 v71.88,4.88
N$113  (via drill 0.61)
  Top 0.254: v96.62,9.38 98.12,9.38 ADC.6 | v75.75,5.12 75.75,2.12 CN2.4
  Bottom 0.254: v96.62,9.38 96.12,9.38 90.12,15.38 84.75,15.38 75.75,6.38 v75.75,5.12
N$114  (via drill 0.61)
  Top 0.254: v7.75,31.88 7.75,30.5 J5.2 | v20.12,22.62 v16.62,22.62 | v42,48.62 43.25,48.62 v47.75,53.12 | v46.75,58.62 46.75,59.25 47.62,60.12 47.62,60.88 CN1.47
  Bottom 0.254: v7.75,31.88 7.75,31.5 v16.62,22.62 | v20.12,22.62 20.12,23 42,44.88 v42,48.62 | v47.75,53.12 47.75,55.75 46.62,56.88 46.62,58.5 v46.75,58.62
N$115  (via drill 0.61)
  Top 0.254: v63.88,49.38 64.75,49.38 80.12,34 94.88,34 96.25,32.62 98,32.62 J4.1 | v63.88,53.12 63.88,54.75 64.12,55 CN1.22
  Bottom 0.254: v63.88,53.12 v63.88,49.38
N$116  (via drill 0.61)
  Top 0.254: v78.62,51.12 94.25,51.12 J3.4 | v66.62,59 65.5,60.12 65.5,60.88 CN1.19
  Bottom 0.254: v78.62,51.12 74.38,55.38 70.5,55.38 67.75,58.12 67.5,58.12 v66.62,59
N$117  (via drill 0.61)
  Top 0.254: v31.12,10 31.12,8.12 CN2.73 | v29,19.5 31,19.5 v41.12,29.62 | v51.88,39.5 56.12,39.5 59.12,42.5 59.12,43.38 v56.75,45.75
  Bottom 0.254: v31.12,10 30.12,10 29.25,9.12 28.75,9.12 28.12,9.75 28.12,18.62 v29,19.5 | v41.12,29.62 43.25,29.62 46.25,32.62 46.25,36.5 47.88,38.12 51,38.12 51.88,39 v51.88,39.5 | v56.75,45.75 55.25,45.75 54.38,46.62 J2.28
N$118  (via drill 0.61)
  Top 0.254: v29.88,11.5 29.88,8.12 CN2.75 | v51.62,41.25 57.25,41.25 58.62,42.62 58.62,43.12 56.88,44.88 56.5,44.88 55.88,45.5 55.88,46.25 v56.75,47.12
  Bottom 0.254: v29.88,11.5 29.88,25.12 40,35.25 41,35.25 41.62,35.88 41.62,36.88 47.38,42.62 50.88,42.62 51.62,41.88 v51.62,41.25 | v56.75,47.12 54.75,49.12 54.38,49.12 J2.30
N$119  (via drill 0.61)
  Top 0.254: v29,10 28.75,9.75 28.75,8.12 CN2.77 | v38.88,33 38.88,37 v52.38,50.5
  Bottom 0.254: v29,10 29.5,10 30.75,11.25 30.75,15.38 30.38,15.75 30.38,25 38.38,33 v38.88,33 | v52.38,50.5 53,50.5 54.25,51.75 J2.32
N$120  (via drill 0.61)
  Top 0.254: CN2.79 27.38,10.12 29.88,12.62 v31.62,12.62
  Bottom 0.254: v31.62,12.62 35.38,16.38 35.38,17 36,17.62 42.88,17.62 44.75,15.75 44.75,14.62 43.75,13.62 43.75,12 44.88,10.88 45.5,10.88 46.75,12.12 51.38,12.12 52.38,11.12 54.25,11.12 J2.34
N$122  (via drill 0.61)
  Top 0.254: v78,56.25 94.25,56.25 J3.8 | v65,59 64.12,59 63,60.12 63,60.88 CN1.23
  Bottom 0.254: v78,56.25 77.38,56.25 73.75,59.88 65.88,59.88 v65,59
N$146  (via drill 0.61)
  Top 0.254: v45.12,4.75 45.12,2.12 CN2.52 | v43.88,15.5 43.88,16.62 43.5,17 43.5,17.5 v59.88,33.88
  Bottom 0.254: v45.12,4.75 45.12,5 38,12.12 38,13.75 39.75,15.5 v43.88,15.5 | v59.88,33.88 70,33.88 J1.4
N$166  (via drill 0.61)
  Top 0.254: v17,25.88 17.5,25.88 v24.38,32.75 | v38.75,48.25 v31,40.5 | v42.62,50.5 46.38,54.25 46.38,55 CN1.50
  Bottom 0.254: v17,25.88 18.25,25.88 LCD.13 | v24.38,32.75 24.38,33.88 v31,40.5 | v38.75,48.25 41.12,50.62 42.5,50.62 v42.62,50.5
N$168  (via drill 0.61)
  Top 0.254: v41.5,56.88 42.5,55.88 42.5,55.12 CN1.56
  Bottom 0.254: v41.5,56.88 40.62,56 39.62,56 37.12,53.5 37.12,52.88 31.88,47.62 31.88,37.25 22.5,27.88 18.38,27.88 LCD.17
N$170  (via drill 0.61)
  Top 0.254: v22.62,33.25 22.62,41.25 34,52.62 v35.25,52.62 | v39.5,56.88 39.5,55.62 40,55.12 CN1.60
  Bottom 0.254: v22.62,33.25 19.25,29.88 18.38,29.88 LCD.21 | v39.5,56.88 v35.25,52.62
N$172  (via drill 0.61)
  Top 0.254: v96,4.25 94.5,4.25 ADC.9 | v80.62,6.12 78.88,6.12 77,8 CN2.1 | v40.75,36.12 40.75,36.38 52.38,48 58.12,48 v58.5,47.62 | v78,60.38 77.5,60.38 77,60.88 CN1.1
  Bottom 0.254: v80.62,6.12 82.5,4.25 v96,4.25 95.88,4.12 95.88,2.88 96.5,2.25 97,2.25 97.62,2.88 97.62,53 90.25,60.38 v78,60.38 65.25,60.38 62.12,57.25 62.12,50.12 59.62,47.62 v58.5,47.62 | LCD.1 18.38,19.88 18.38,20.25 LCD.2 18.5,20.25 24.38,20.25 40.25,36.12 v40.75,36.12
N$173  (via drill 0.61)
  Top 0.254: v15.5,38.75 v17,40.25 | v16,41.88 17.12,41.88 v27.88,52.62 | v33.38,59 33.38,60.62 33.62,60.88 CN1.69
  Bottom 0.254: v17,40.25 18.25,40.25 LCD.42 | v15.5,38.75 15.5,41.38 v16,41.88 | v27.88,52.62 27.88,53.12 31.38,56.62 31.38,57.12 33.25,59 v33.38,59
(copper drawn outside any net)
  shapes: Bottom area x6

### Text on the board
Bottom: 1 | MISC | CN1 | J3 | 1 | 1 | 1 | J4 | I2S | 1 | 1 | J1 | 1 | J5 | J2 | MIO | 1 | ADC | 11 | J6 | CN2 | 1